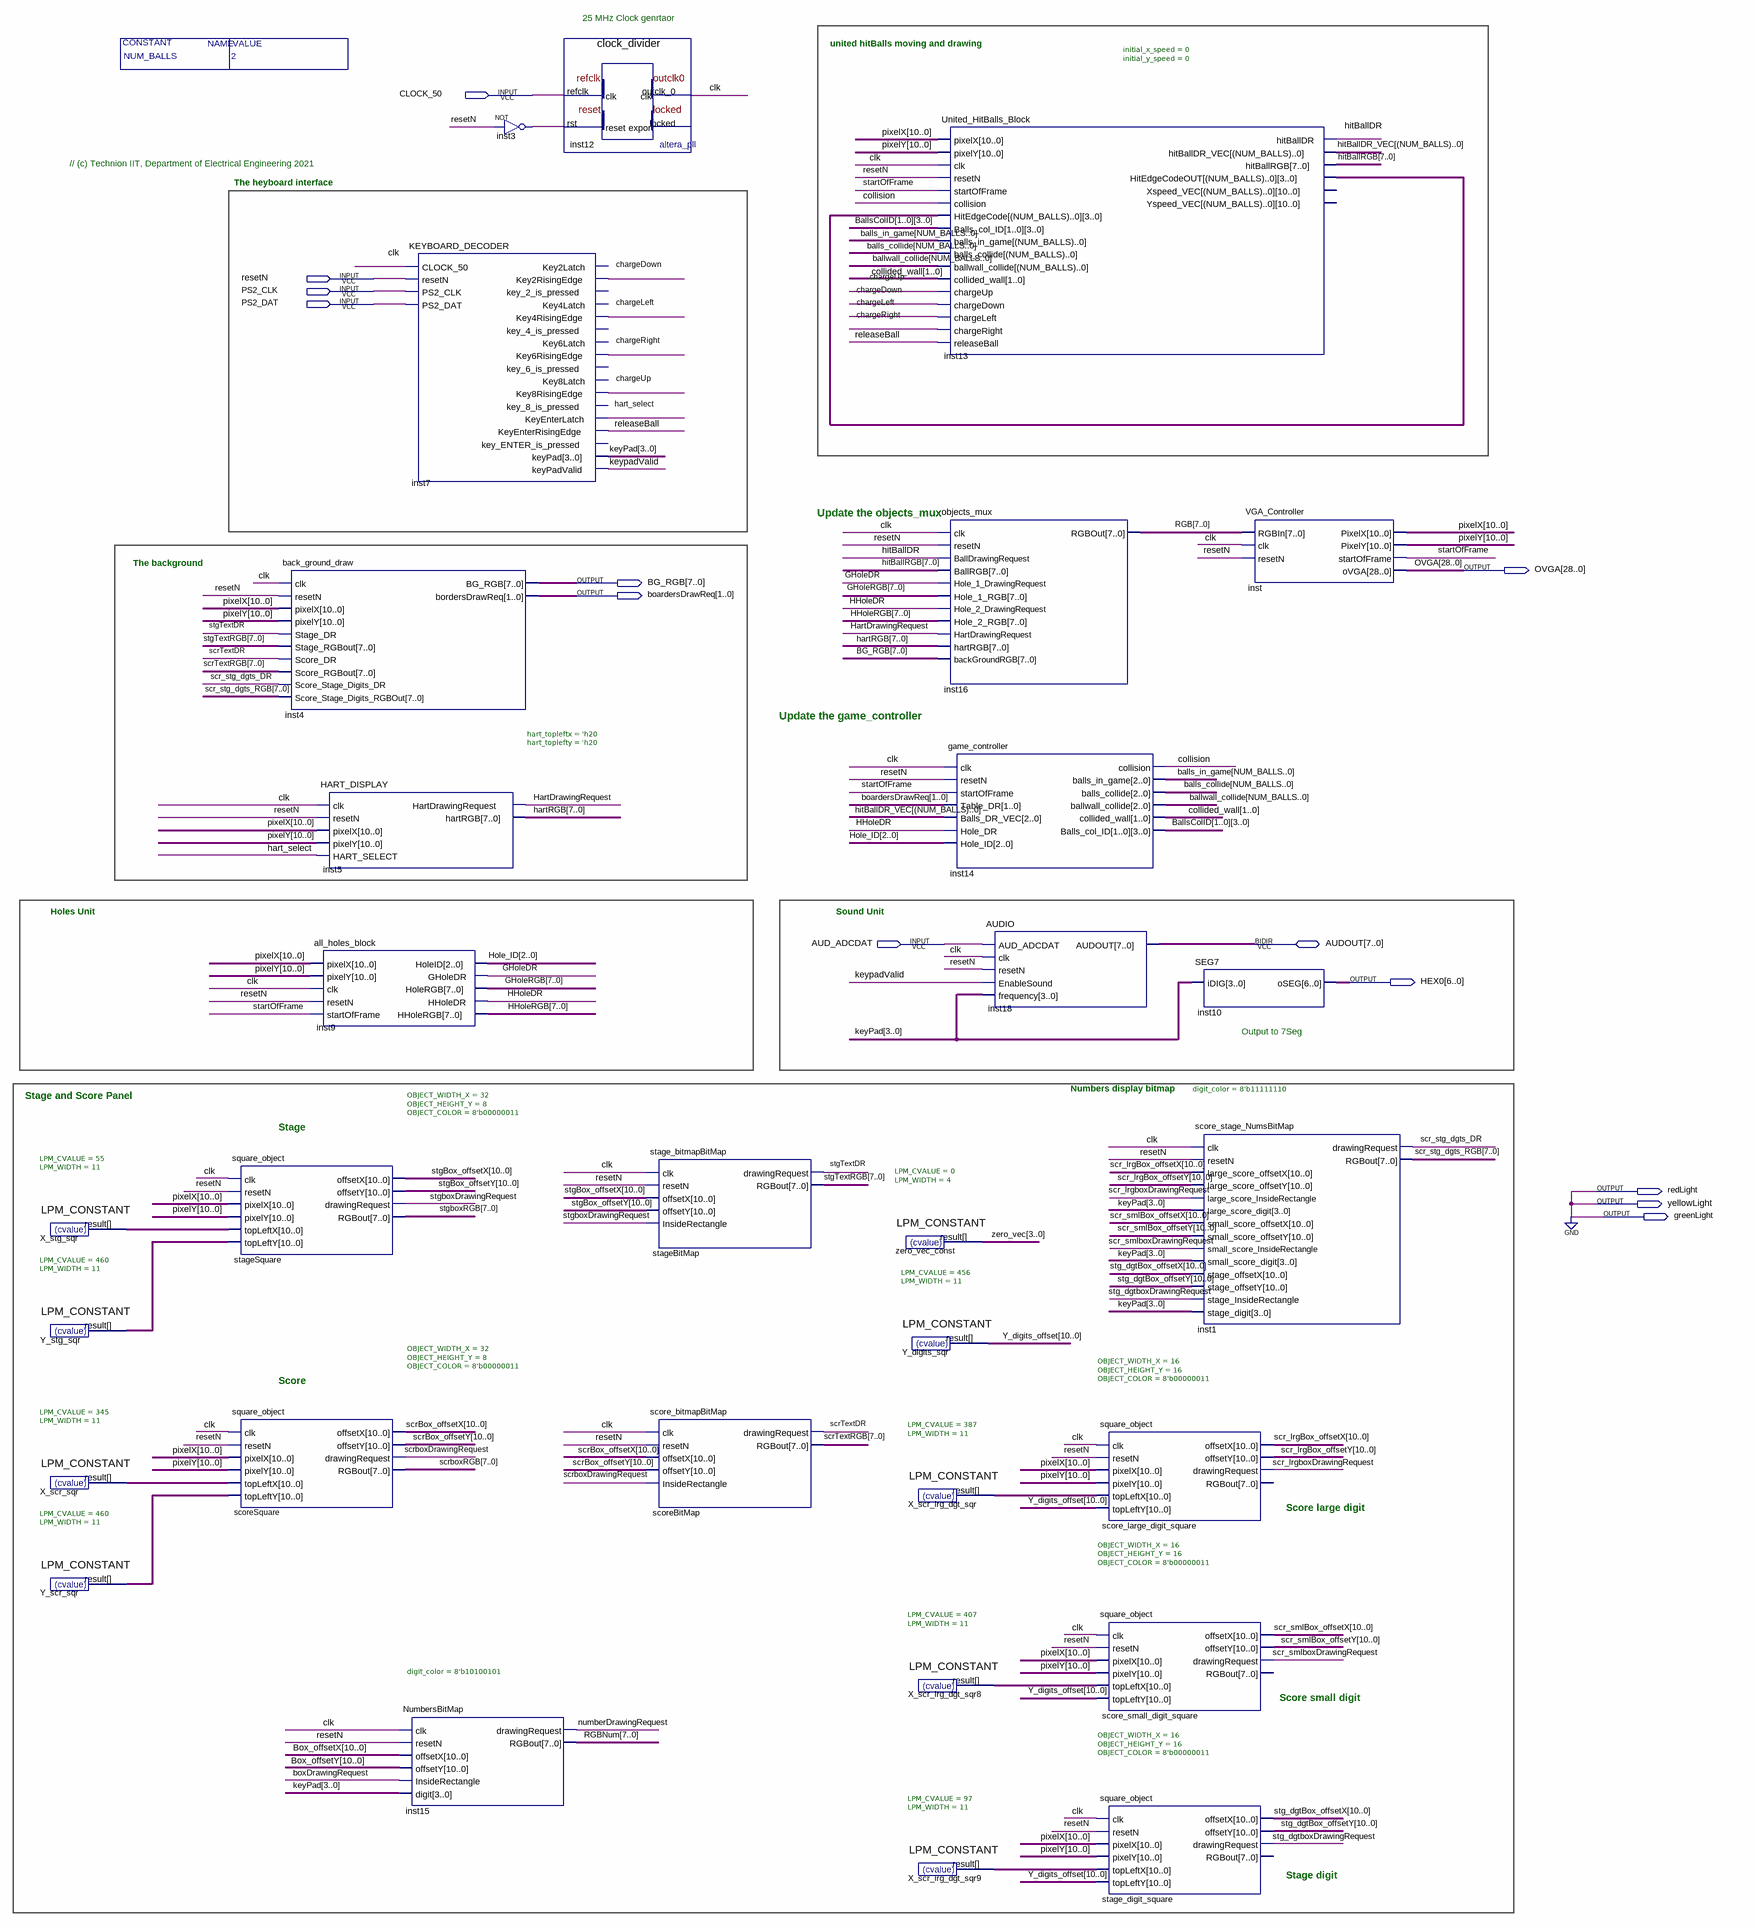
[diagram p0: schematic sheet]
// Quartus schematic TOP_VGA_DEMO_KBD.bdf as structural Verilog: 30 symbols, 13 pins
module TOP_VGA_DEMO_KBD #(parameter NUM_BALLS = 2) (
  input  CLOCK_50,
  input  resetN,
  input  PS2_CLK,
  input  PS2_DAT,
  input  AUD_ADCDAT,
  inout  [7:0] AUDOUT,
  output [28:0] OVGA,
  output [7:0] BG_RGB,
  output [1:0] boardersDrawReq,
  output [6:0] HEX0,
  output redLight,
  output yellowLight,
  output greenLight
);

  wire boxDrawingRequest, chargeDown, chargeLeft, chargeRight, chargeUp, clk, collision, GHoleDR,
       hart_select, HartDrawingRequest, HHoleDR, hitBallDR, inst3_out, keypadValid, numberDrawingRequest,
       releaseBall, scr_lrgboxDrawingRequest, scr_smlboxDrawingRequest, scr_stg_dgts_DR,
       scrboxDrawingRequest, scrTextDR, startOfFrame, stg_dgtboxDrawingRequest, stgboxDrawingRequest,
       stgTextDR;
  wire [1:0] collided_wall;
  wire [2:0] balls_collide, balls_in_game, ballwall_collide, hitBallDR_VEC, Hole_ID;
  wire [3:0] BallsColID_0, BallsColID_1, keyPad, zero_vec;
  wire [7:0] GHoleRGB, hartRGB, HHoleRGB, hitBallRGB, RGB, RGBNum, scr_stg_dgts_RGB, scrboxRGB, scrTextRGB,
       stgboxRGB, stgTextRGB;
  wire [10:0] Box_offsetX, Box_offsetY, pixelX, pixelY, scr_lrgBox_offsetX, scr_lrgBox_offsetY,
       scr_smlBox_offsetX, scr_smlBox_offsetY, scrBox_offsetX, scrBox_offsetY, stg_dgtBox_offsetX,
       stg_dgtBox_offsetY, stgBox_offsetX, stgBox_offsetY, X_scr_lrg_dgt_sqr8_result,
       X_scr_lrg_dgt_sqr9_result, X_scr_lrg_dgt_sqr_result, X_scr_sqr_result, X_stg_sqr_result,
       Y_digits_offset, Y_scr_sqr_result, Y_stg_sqr_result;
  wire [11:0] inst13_hitedgecodeout;

  LPM_CONSTANT #(.LPM_CVALUE(55), .LPM_WIDTH(11)) X_stg_sqr (.result(X_stg_sqr_result));
  LPM_CONSTANT #(.LPM_CVALUE(460), .LPM_WIDTH(11)) Y_stg_sqr (.result(Y_stg_sqr_result));
  LPM_CONSTANT #(.LPM_CVALUE(345), .LPM_WIDTH(11)) X_scr_sqr (.result(X_scr_sqr_result));
  LPM_CONSTANT #(.LPM_CVALUE(460), .LPM_WIDTH(11)) Y_scr_sqr (.result(Y_scr_sqr_result));
  square_object #(.OBJECT_WIDTH_X(32), .OBJECT_HEIGHT_Y(8), .OBJECT_COLOR(8'b00000011)) stageSquare (
    .clk(clk), .resetN(resetN), .pixelX(pixelX), .pixelY(pixelY), .topLeftX(X_stg_sqr_result),
    .topLeftY(Y_stg_sqr_result), .offsetX(stgBox_offsetX), .offsetY(stgBox_offsetY),
    .drawingRequest(stgboxDrawingRequest), .RGBout(stgboxRGB));
  square_object #(.OBJECT_WIDTH_X(32), .OBJECT_HEIGHT_Y(8), .OBJECT_COLOR(8'b00000011)) scoreSquare (
    .clk(clk), .resetN(resetN), .pixelX(pixelX), .pixelY(pixelY), .topLeftX(X_scr_sqr_result),
    .topLeftY(Y_scr_sqr_result), .offsetX(scrBox_offsetX), .offsetY(scrBox_offsetY),
    .drawingRequest(scrboxDrawingRequest), .RGBout(scrboxRGB));
  back_ground_draw inst4 (
    .clk(clk), .resetN(resetN), .pixelX(pixelX), .pixelY(pixelY), .Stage_DR(stgTextDR),
    .Stage_RGBout(stgTextRGB), .Score_DR(scrTextDR), .Score_RGBout(scrTextRGB),
    .Score_Stage_Digits_DR(scr_stg_dgts_DR), .Score_Stage_Digits_RGBOut(scr_stg_dgts_RGB), .BG_RGB(BG_RGB),
    .bordersDrawReq(boardersDrawReq));
  all_holes_block inst9 (
    .pixelX(pixelX), .pixelY(pixelY), .clk(clk), .resetN(resetN), .startOfFrame(startOfFrame),
    .HoleID(Hole_ID), .GHoleDR(GHoleDR), .HoleRGB(GHoleRGB), .HHoleDR(HHoleDR), .HHoleRGB(HHoleRGB));
  HART_DISPLAY #(.hart_topleftx('h20), .hart_toplefty('h20)) inst5 (
    .clk(clk), .resetN(resetN), .pixelX(pixelX), .pixelY(pixelY), .HART_SELECT(hart_select),
    .HartDrawingRequest(HartDrawingRequest), .hartRGB(hartRGB));
  KEYBOARD_DECODER inst7 (
    .CLOCK_50(clk), .resetN(resetN), .PS2_CLK(PS2_CLK), .PS2_DAT(PS2_DAT), .Key2RisingEdge(chargeDown),
    .Key4RisingEdge(chargeLeft), .Key6RisingEdge(chargeRight), .Key8RisingEdge(chargeUp),
    .KeyEnterLatch(hart_select), .KeyEnterRisingEdge(releaseBall), .keyPad(keyPad), .keyPadValid(keypadValid));  // open: Key2Latch, key_2_is_pressed, Key4Latch, key_4_is_pressed, Key6Latch, key_6_is_pressed, Key8Latch, key_8_is_pressed, key_ENTER_is_pressed
  NumbersBitMap #(.digit_color(8'b10100101)) inst15 (
    .clk(clk), .resetN(resetN), .offsetX(Box_offsetX), .offsetY(Box_offsetY),
    .InsideRectangle(boxDrawingRequest), .digit(keyPad), .drawingRequest(numberDrawingRequest),
    .RGBout(RGBNum));
  not inst3 (inst3_out, resetN);
  clock_divider inst12 (.refclk(CLOCK_50), .rst(inst3_out), .outclk_0(clk));  // open: locked
  stage_bitmapBitMap stageBitMap (
    .clk(clk), .resetN(resetN), .offsetX(stgBox_offsetX), .offsetY(stgBox_offsetY),
    .InsideRectangle(stgboxDrawingRequest), .drawingRequest(stgTextDR), .RGBout(stgTextRGB));
  score_bitmapBitMap scoreBitMap (
    .clk(clk), .resetN(resetN), .offsetX(scrBox_offsetX), .offsetY(scrBox_offsetY),
    .InsideRectangle(scrboxDrawingRequest), .drawingRequest(scrTextDR), .RGBout(scrTextRGB));
  LPM_CONSTANT #(.LPM_CVALUE(0), .LPM_WIDTH(4)) zero_vec_const (.result(zero_vec));
  LPM_CONSTANT #(.LPM_CVALUE(456), .LPM_WIDTH(11)) Y_digits_sqr (.result(Y_digits_offset));
  LPM_CONSTANT #(.LPM_CVALUE(387), .LPM_WIDTH(11)) X_scr_lrg_dgt_sqr (.result(X_scr_lrg_dgt_sqr_result));
  LPM_CONSTANT #(.LPM_CVALUE(407), .LPM_WIDTH(11)) X_scr_lrg_dgt_sqr8 (.result(X_scr_lrg_dgt_sqr8_result));
  LPM_CONSTANT #(.LPM_CVALUE(97), .LPM_WIDTH(11)) X_scr_lrg_dgt_sqr9 (.result(X_scr_lrg_dgt_sqr9_result));
  United_HitBalls_Block #(.initial_x_speed(0), .initial_y_speed(0)) inst13 (
    .pixelX(pixelX), .pixelY(pixelY), .clk(clk), .resetN(resetN), .startOfFrame(startOfFrame),
    .collision(collision), .HitEdgeCode(inst13_hitedgecodeout), .Balls_col_ID({BallsColID_1, BallsColID_0}),
    .balls_in_game(balls_in_game), .balls_collide(balls_collide), .ballwall_collide(ballwall_collide),
    .collided_wall(collided_wall), .chargeUp(chargeUp), .chargeDown(chargeDown), .chargeLeft(chargeLeft),
    .chargeRight(chargeRight), .releaseBall(releaseBall), .hitBallDR(hitBallDR),
    .hitBallDR_VEC(hitBallDR_VEC), .hitBallRGB(hitBallRGB), .HitEdgeCodeOUT(inst13_hitedgecodeout));  // open: Xspeed_VEC, Yspeed_VEC
  objects_mux inst16 (
    .clk(clk), .resetN(resetN), .BallDrawingRequest(hitBallDR), .BallRGB(hitBallRGB),
    .Hole_1_DrawingRequest(GHoleDR), .Hole_1_RGB(GHoleRGB), .Hole_2_DrawingRequest(HHoleDR),
    .Hole_2_RGB(HHoleRGB), .HartDrawingRequest(HartDrawingRequest), .hartRGB(hartRGB),
    .backGroundRGB(BG_RGB), .RGBOut(RGB));
  game_controller inst14 (
    .clk(clk), .resetN(resetN), .startOfFrame(startOfFrame), .Table_DR(boardersDrawReq),
    .Balls_DR_VEC(hitBallDR_VEC), .Hole_DR(HHoleDR), .Hole_ID(Hole_ID), .collision(collision),
    .balls_in_game(balls_in_game), .balls_collide(balls_collide), .ballwall_collide(ballwall_collide),
    .collided_wall(collided_wall), .Balls_col_ID({BallsColID_1, BallsColID_0}));
  AUDIO inst18 (
    .AUD_ADCDAT(AUD_ADCDAT), .clk(clk), .resetN(resetN), .EnableSound(keypadValid), .frequency(keyPad),
    .AUDOUT(AUDOUT));
  square_object #(.OBJECT_WIDTH_X(16), .OBJECT_HEIGHT_Y(16), .OBJECT_COLOR(8'b00000011)) score_large_digit_square (
    .clk(clk), .resetN(resetN), .pixelX(pixelX), .pixelY(pixelY), .topLeftX(X_scr_lrg_dgt_sqr_result),
    .topLeftY(Y_digits_offset), .offsetX(scr_lrgBox_offsetX), .offsetY(scr_lrgBox_offsetY),
    .drawingRequest(scr_lrgboxDrawingRequest));  // open: RGBout
  square_object #(.OBJECT_WIDTH_X(16), .OBJECT_HEIGHT_Y(16), .OBJECT_COLOR(8'b00000011)) score_small_digit_square (
    .clk(clk), .resetN(resetN), .pixelX(pixelX), .pixelY(pixelY), .topLeftX(X_scr_lrg_dgt_sqr8_result),
    .topLeftY(Y_digits_offset), .offsetX(scr_smlBox_offsetX), .offsetY(scr_smlBox_offsetY),
    .drawingRequest(scr_smlboxDrawingRequest));  // open: RGBout
  square_object #(.OBJECT_WIDTH_X(16), .OBJECT_HEIGHT_Y(16), .OBJECT_COLOR(8'b00000011)) stage_digit_square (
    .clk(clk), .resetN(resetN), .pixelX(pixelX), .pixelY(pixelY), .topLeftX(X_scr_lrg_dgt_sqr9_result),
    .topLeftY(Y_digits_offset), .offsetX(stg_dgtBox_offsetX), .offsetY(stg_dgtBox_offsetY),
    .drawingRequest(stg_dgtboxDrawingRequest));  // open: RGBout
  SEG7 inst10 (.iDIG(keyPad), .oSEG(HEX0));
  score_stage_NumsBitMap #(.digit_color(8'b11111110)) inst1 (
    .clk(clk), .resetN(resetN), .large_score_offsetX(scr_lrgBox_offsetX),
    .large_score_offsetY(scr_lrgBox_offsetY), .large_score_InsideRectangle(scr_lrgboxDrawingRequest),
    .large_score_digit(keyPad), .small_score_offsetX(scr_smlBox_offsetX),
    .small_score_offsetY(scr_smlBox_offsetY), .small_score_InsideRectangle(scr_smlboxDrawingRequest),
    .small_score_digit(keyPad), .stage_offsetX(stg_dgtBox_offsetX), .stage_offsetY(stg_dgtBox_offsetY),
    .stage_InsideRectangle(stg_dgtboxDrawingRequest), .stage_digit(keyPad), .drawingRequest(scr_stg_dgts_DR),
    .RGBout(scr_stg_dgts_RGB));
  VGA_Controller inst (
    .RGBIn(RGB), .clk(clk), .resetN(resetN), .PixelX(pixelX), .PixelY(pixelY), .startOfFrame(startOfFrame),
    .oVGA(OVGA));

  assign greenLight = 1'b0;
  assign redLight = 1'b0;
  assign yellowLight = 1'b0;

  // Notes on the sheet:
  //   25 MHz Clock genrtaor
  //   united hitBalls moving and drawing
  //   // (c) Technion IIT, Department of Electrical Engineering 2021
  //   The heyboard interface
  //   Update the objects_mux
  //   The background
  //   Update the game_controller
  //   Holes Unit         
  //   Sound Unit
  //   Output to 7Seg
  //   Numbers display bitmap
  //   Stage and Score Panel              
  //   Stage       
  //   Score      
  //   Score large digit     
  //   Score small digit     
  //   Stage digit     
endmodule
